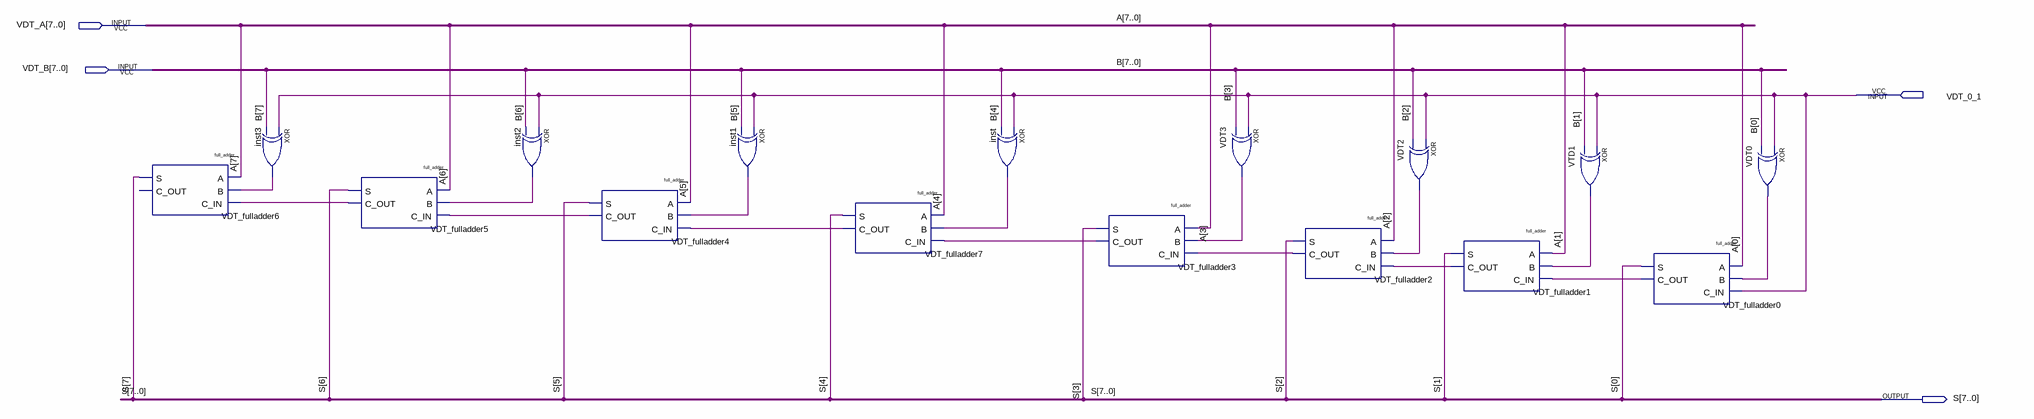
[diagram p0: schematic sheet]
// Quartus schematic 8_bit_adder.bdf as structural Verilog: 16 symbols, 4 pins
module \8_bit_adder  (
  input  [7:0] VDT_A,
  input  [7:0] VDT_B,
  input  VDT_0_1,
  output [7:0] S
);

  wire inst1_out, inst2_out, inst3_out, inst_out, VDT0_out, VDT2_out, VDT3_out, VDT_fulladder0_c_out,
       VDT_fulladder1_c_out, VDT_fulladder2_c_out, VDT_fulladder3_c_out, VDT_fulladder4_c_out,
       VDT_fulladder5_c_out, VDT_fulladder7_c_out, VTD1_out;

  full_adder VDT_fulladder6 (.A(VDT_A[7]), .B(inst3_out), .C_IN(VDT_fulladder5_c_out), .S(S[7]));  // open: C_OUT
  xor inst3 (inst3_out, VDT_0_1, VDT_B[7]);
  full_adder VDT_fulladder5 (
    .A(VDT_A[6]), .B(inst2_out), .C_IN(VDT_fulladder4_c_out), .S(S[6]), .C_OUT(VDT_fulladder5_c_out));
  xor inst2 (inst2_out, VDT_0_1, VDT_B[6]);
  full_adder VDT_fulladder4 (
    .A(VDT_A[5]), .B(inst1_out), .C_IN(VDT_fulladder7_c_out), .S(S[5]), .C_OUT(VDT_fulladder4_c_out));
  xor inst1 (inst1_out, VDT_0_1, VDT_B[5]);
  full_adder VDT_fulladder7 (
    .A(VDT_A[4]), .B(inst_out), .C_IN(VDT_fulladder3_c_out), .S(S[4]), .C_OUT(VDT_fulladder7_c_out));
  xor inst (inst_out, VDT_0_1, VDT_B[4]);
  full_adder VDT_fulladder3 (
    .A(VDT_A[3]), .B(VDT3_out), .C_IN(VDT_fulladder2_c_out), .S(S[3]), .C_OUT(VDT_fulladder3_c_out));
  xor VDT3 (VDT3_out, VDT_0_1, VDT_B[3]);
  full_adder VDT_fulladder2 (
    .A(VDT_A[2]), .B(VDT2_out), .C_IN(VDT_fulladder1_c_out), .S(S[2]), .C_OUT(VDT_fulladder2_c_out));
  xor VDT2 (VDT2_out, VDT_0_1, VDT_B[2]);
  full_adder VDT_fulladder1 (
    .A(VDT_A[1]), .B(VTD1_out), .C_IN(VDT_fulladder0_c_out), .S(S[1]), .C_OUT(VDT_fulladder1_c_out));
  xor VTD1 (VTD1_out, VDT_0_1, VDT_B[1]);
  full_adder VDT_fulladder0 (.A(VDT_A[0]), .B(VDT0_out), .C_IN(VDT_0_1), .S(S[0]), .C_OUT(VDT_fulladder0_c_out));
  xor VDT0 (VDT0_out, VDT_0_1, VDT_B[0]);

  // Other names for the same wires on the sheet: A[7:0] = VDT_A; B[7:0] = VDT_B
endmodule
